# Altium project TableClock.PrjPcb
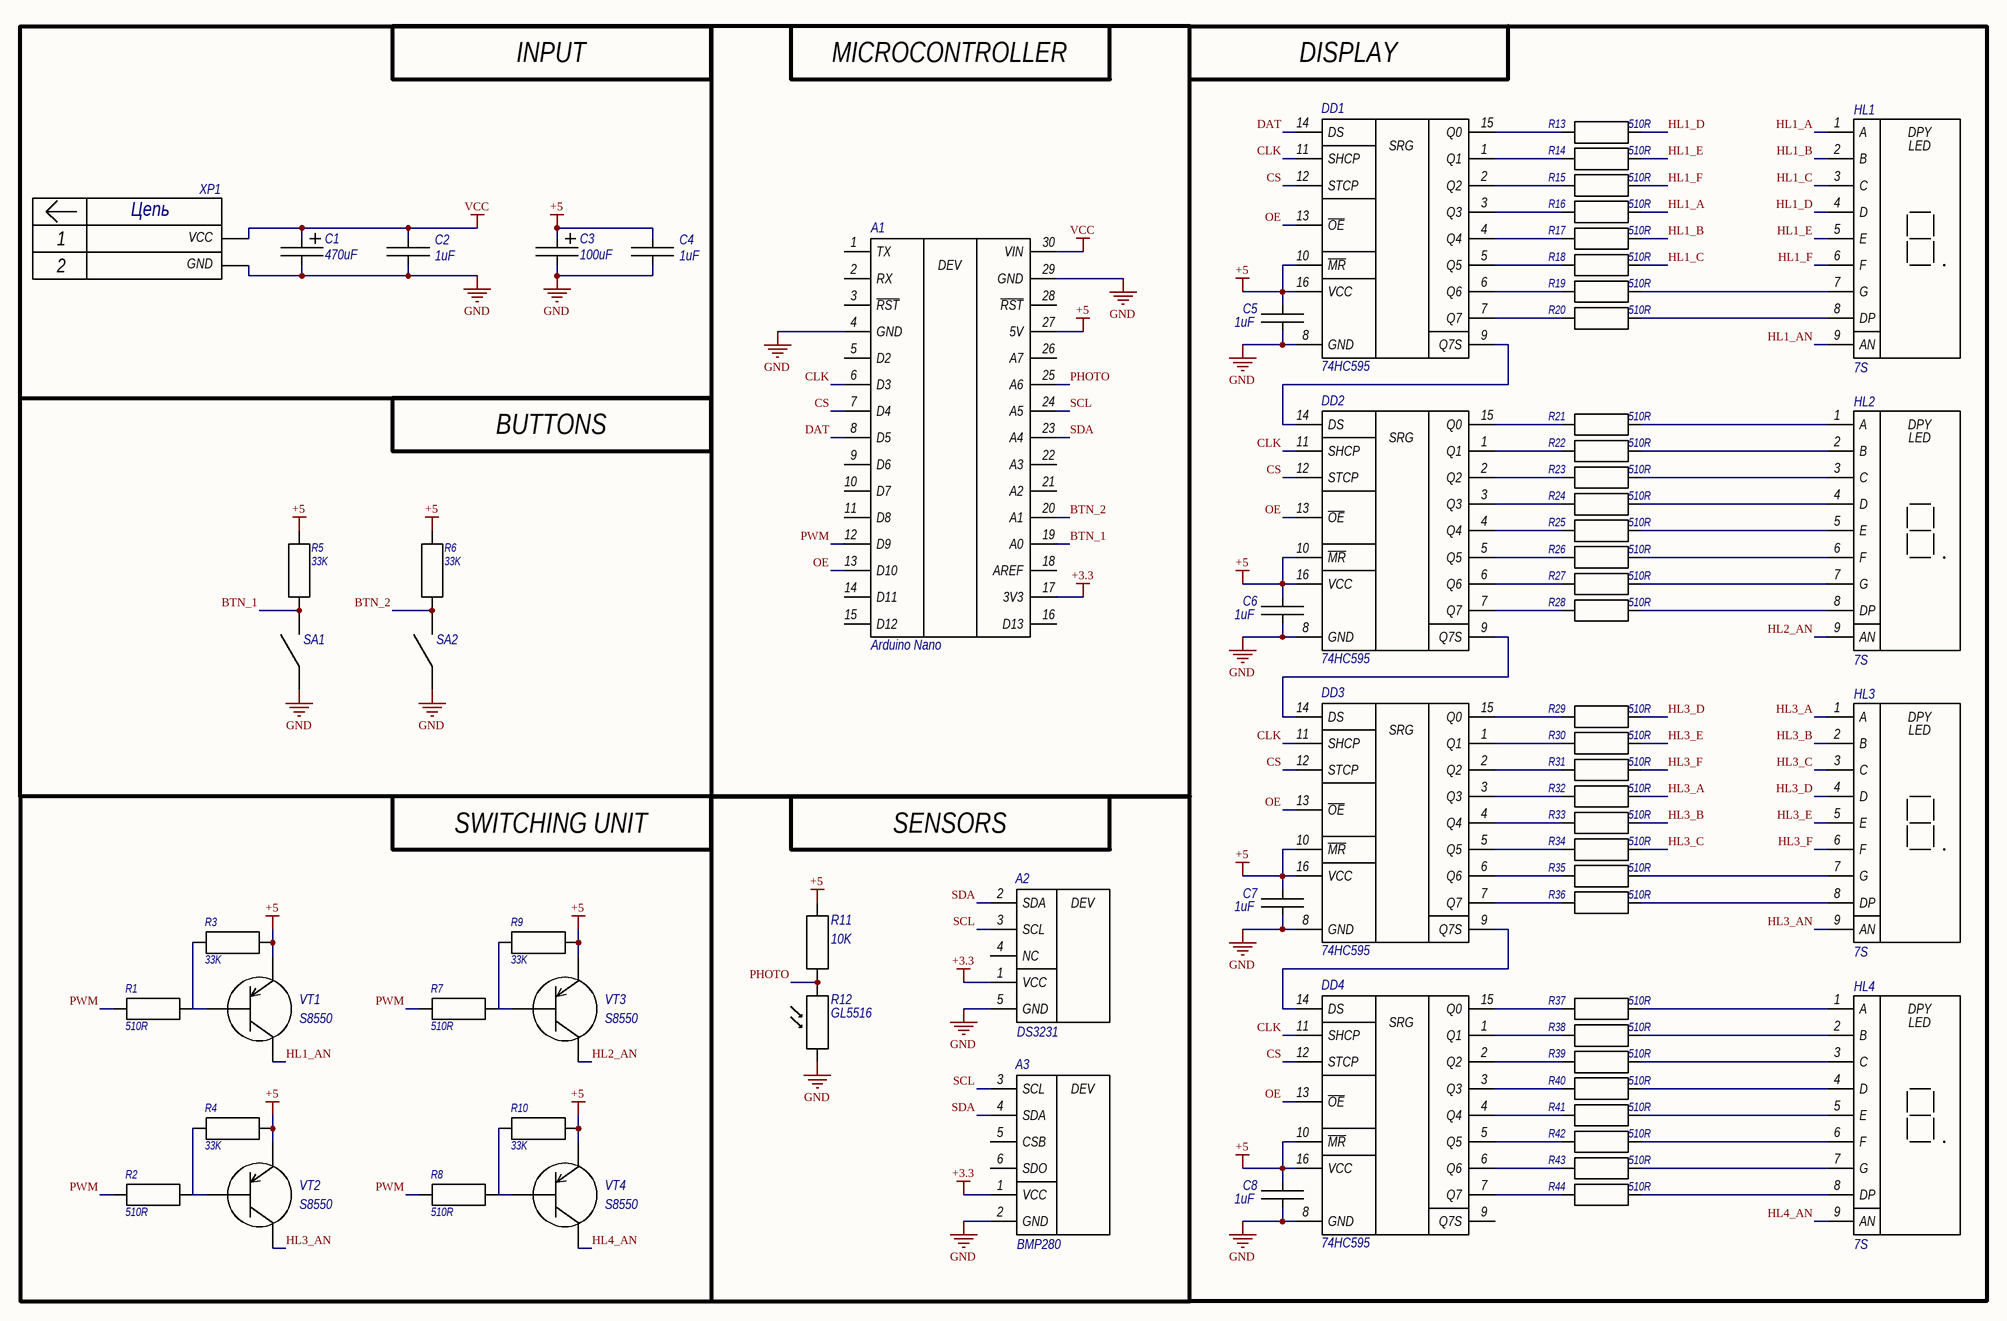
[diagram p0: Схема_часов.SchDoc]
1 sheet, 70 parts. Net scope: global (net labels, ports and power ports of the same name join across sheets).
Board file: Плата_часов.PcbDoc

## Sheet Схема_часов.SchDoc
size A0; SheetNumber: 1; SheetTotal: 1

### Parts
A1  Arduino Nano  [ArduinoNano]
A2  DS3231  [DS3231micro]
A3  BMP280  [BMP280_Module]
C1  470uF  [CAPAER_D0650_L1150_P0250_W50X300]
C2  1uF  [C0603]
C3  100uF  [CAPAE_R0500_X0540(Nich_Case-C5)]
C4  1uF  [C0603]
C5  1uF  [C0603]
C6  1uF  [C0603]
C7  1uF  [C0603]
C8  1uF  [C0603]
DD1  74HC595  [SO-16]
DD2  74HC595  [SO-16]
DD3  74HC595  [SO-16]
DD4  74HC595  [SO-16]
HL1  7S  [7SEG_SA10_21]
HL2  7S  [7SEG_SA10_21]
HL3  7S  [7SEG_SA10_21]
HL4  7S  [7SEG_SA10_21]
R1  510R  [R0805]
R2  510R  [R0805]
R3  33K  [R0805]
R4  33K  [R0805]
R5  33K  [R0805]
R6  33K  [R0805]
R7  510R  [R0805]
R8  510R  [R0805]
R9  33K  [R0805]
R10  33K  [R0805]
R11  10K  [R0805]
R12  GL5516  [GL55]
R13  510R  [R0805]
R14  510R  [R0805]
R15  510R  [R0805]
R16  510R  [R0805]
R17  510R  [R0805]
R18  510R  [R0805]
R19  510R  [R0805]
R20  510R  [R0805]
R21  510R  [R0805]
R22  510R  [R0805]
R23  510R  [R0805]
R24  510R  [R0805]
R25  510R  [R0805]
R26  510R  [R0805]
R27  510R  [R0805]
R28  510R  [R0805]
R29  510R  [R0805]
R30  510R  [R0805]
R31  510R  [R0805]
R32  510R  [R0805]
R33  510R  [R0805]
R34  510R  [R0805]
R35  510R  [R0805]
R36  510R  [R0805]
R37  510R  [R0805]
R38  510R  [R0805]
R39  510R  [R0805]
R40  510R  [R0805]
R41  510R  [R0805]
R42  510R  [R0805]
R43  510R  [R0805]
R44  510R  [R0805]
SA1  (no value)  [TS6606-9.0]
SA2  (no value)  [TS6606-9.0]
VT1  (no value)  [S8550]
VT2  (no value)  [S8550]
VT3  (no value)  [S8550]
VT4  (no value)  [S8550]
XP1  NET 2: GND  NET 1: VCC  [PLS2-2]  (hidden comment: DS1072-2MVT6)

### Blocks framed on the sheet
DISPLAY: C5-C8 DD1-DD4 HL1-HL4 R13-R44

### Nets
+3.3: A1.17(3V3) A2.1(VCC) A3.1(VCC)
+5: A1.27(5V) C3.1 C4.2 C5.1 C6.1 C7.1 C8.1 DD1.10(~{MR}) DD1.16(VCC) DD2.10(~{MR}) DD2.16(VCC) DD3.10(~{MR}) DD3.16(VCC) DD4.10(~{MR}) DD4.16(VCC) R3.1 R4.1 R5.1 R6.1 R9.1 R10.1 R11.1 VT1.E VT2.E VT3.E VT4.E
GND: A1.4(GND) A1.29(GND) A2.5(GND) A3.2(GND) C1.2 C2.1 C3.2 C4.1 C5.2 C6.2 C7.2 C8.2 DD1.8(GND) DD2.8(GND) DD3.8(GND) DD4.8(GND) R12.2 SA1.2 SA2.2 XP1.2
VCC: A1.30(VIN) C1.1 C2.2 XP1.1
BTN_1: A1.19(A0) R5.2 SA1.1
BTN_2: A1.20(A1) R6.2 SA2.1
CLK: A1.6(D3) DD1.11(SHCP) DD2.11(SHCP) DD3.11(SHCP) DD4.11(SHCP)
CS: A1.7(D4) DD1.12(STCP) DD2.12(STCP) DD3.12(STCP) DD4.12(STCP)
DAT: A1.8(D5) DD1.14(DS)
HL1_A: HL1.1(A) R16.1
HL1_AN: HL1.9(AN) VT1.C
HL1_B: HL1.2(B) R17.1
HL1_C: HL1.3(C) R18.1
HL1_D: HL1.4(D) R13.1
HL1_E: HL1.5(E) R14.1
HL1_F: HL1.6(F) R15.1
HL2_AN: HL2.9(AN) VT3.C
HL3_A: HL3.1(A) R32.1
HL3_AN: HL3.9(AN) VT2.C
HL3_B: HL3.2(B) R33.1
HL3_C: HL3.3(C) R34.1
HL3_D: HL3.4(D) R29.1
HL3_E: HL3.5(E) R30.1
HL3_F: HL3.6(F) R31.1
HL4_AN: HL4.9(AN) VT4.C
OE: A1.13(D10) DD1.13(~{OE}) DD2.13(~{OE}) DD3.13(~{OE}) DD4.13(~{OE})
PHOTO: A1.25(A6) R11.2 R12.1
PWM: A1.12(D9) R1.2 R2.2 R7.2 R8.2
SCL: A1.24(A5) A2.3(SCL) A3.3(SCL)
SDA: A1.23(A4) A2.2(SDA) A3.4(SDA)
NetDD1_1: DD1.1(Q1) R14.2
NetDD1_2: DD1.2(Q2) R15.2
NetDD1_3: DD1.3(Q3) R16.2
NetDD1_4: DD1.4(Q4) R17.2
NetDD1_5: DD1.5(Q5) R18.2
NetDD1_6: DD1.6(Q6) R19.2
NetDD1_7: DD1.7(Q7) R20.2
NetDD1_9: DD1.9(Q7S) DD2.14(DS)
NetDD1_15: DD1.15(Q0) R13.2
NetDD2_1: DD2.1(Q1) R22.2
NetDD2_2: DD2.2(Q2) R23.2
NetDD2_3: DD2.3(Q3) R24.2
NetDD2_4: DD2.4(Q4) R25.2
NetDD2_5: DD2.5(Q5) R26.2
NetDD2_6: DD2.6(Q6) R27.2
NetDD2_7: DD2.7(Q7) R28.2
NetDD2_9: DD2.9(Q7S) DD3.14(DS)
NetDD2_15: DD2.15(Q0) R21.2
NetDD3_1: DD3.1(Q1) R30.2
NetDD3_2: DD3.2(Q2) R31.2
NetDD3_3: DD3.3(Q3) R32.2
NetDD3_4: DD3.4(Q4) R33.2
NetDD3_5: DD3.5(Q5) R34.2
NetDD3_6: DD3.6(Q6) R35.2
NetDD3_7: DD3.7(Q7) R36.2
NetDD3_9: DD3.9(Q7S) DD4.14(DS)
NetDD3_15: DD3.15(Q0) R29.2
NetDD4_1: DD4.1(Q1) R38.2
NetDD4_2: DD4.2(Q2) R39.2
NetDD4_3: DD4.3(Q3) R40.2
NetDD4_4: DD4.4(Q4) R41.2
NetDD4_5: DD4.5(Q5) R42.2
NetDD4_6: DD4.6(Q6) R43.2
NetDD4_7: DD4.7(Q7) R44.2
NetDD4_15: DD4.15(Q0) R37.2
NetHL1_7: HL1.7(G) R19.1
NetHL1_8: HL1.8(DP) R20.1
NetHL2_1: HL2.1(A) R21.1
NetHL2_2: HL2.2(B) R22.1
NetHL2_3: HL2.3(C) R23.1
NetHL2_4: HL2.4(D) R24.1
NetHL2_5: HL2.5(E) R25.1
NetHL2_6: HL2.6(F) R26.1
NetHL2_7: HL2.7(G) R27.1
NetHL2_8: HL2.8(DP) R28.1
NetHL3_7: HL3.7(G) R35.1
NetHL3_8: HL3.8(DP) R36.1
NetHL4_1: HL4.1(A) R37.1
NetHL4_2: HL4.2(B) R38.1
NetHL4_3: HL4.3(C) R39.1
NetHL4_4: HL4.4(D) R40.1
NetHL4_5: HL4.5(E) R41.1
NetHL4_6: HL4.6(F) R42.1
NetHL4_7: HL4.7(G) R43.1
NetHL4_8: HL4.8(DP) R44.1
NetR1_1: R1.1 R3.2 VT1.B
NetR2_1: R2.1 R4.2 VT2.B
NetR7_1: R7.1 R9.2 VT3.B
NetR8_1: R8.1 R10.2 VT4.B

Not connected (* = marked no-connect by the designer): A1 1(TX) 2(RX) 3(~{RST}) 5(D2) 9(D6) 10(D7) 11(D8) 14(D11) 15(D12) 16(D13) 18(AREF) 21(A2) 22(A3) 26(A7) 28(~{RST}); A2 4(NC); A3 5(CSB) 6(SDO); DD4 9(Q7S)

### Notes on the sheet
- INPUT
- MICROCONTROLLER
- BUTTONS
- SWITCHING UNIT
- SENSORS
- (in symbol 7SEG_AN) DPY; LED
- (in symbol 74HC595) SRG
- (in symbol ArduinoNano) DEV
- (in symbol BMP280_Module) DEV
- (in symbol DS1072-2MVT6) Цепь
- (in symbol DS3231micro) DEV

### Library data of the parts
A1 = ArduinoNano
A2 = DS3231micro
A3 = BMP280_Module
C1 C3 = CPol
C2 C4-C8 = C0603: Ceramic SMT, L*W 1.6x0.8mm, H=(0.8, 0.6)mm
HL1-HL4 = 7SEG_AN
R1-R11 R13-R44 = R0805: SMT, L*W 2.0x1.25mm, H=0.5mm
R12 = Photores
SA1 SA2 = SW
VT1-VT4 = TRANS-PNP: Model: S8550
XP1 = DS1072-2MVT6: 2-pin Straight connector PWL-2; Manufacturer: Connfly; Voltage: 250Vac; Current: 3A; Type: DS1072-2MVT6